# EAGLE design Sens_BMP085_HIH613x (EAGLE 6.3)
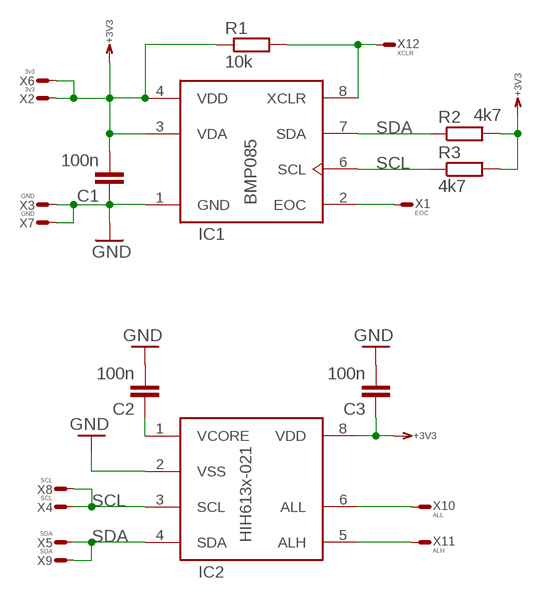
[diagram p0: schematic, sheet 1]

## Parts
C1  100n  C0603  [0603]
C2  100n  C0603  [0603]
C3  100n  C0603  [0603]
IC1  BMP085  [LCC8]
IC2  HIH613x-021  HIH613X  [SO8]
R1  10k  R0603  [0603]
R2  4k7  R0603  [0603]
R3  4k7  R0603  [0603]
X1  EOC  WIREPADR  [S1.27R]
X2  3v3  WIREPADT1.6/0.9  [T1.6/0.9]
X3  GND  WIREPADT1.6/0.9  [T1.6/0.9]
X4  SCL  WIREPADT1.6/0.9  [T1.6/0.9]
X5  SDA  WIREPADT1.6/0.9  [T1.6/0.9]
X6  3v3  WIREPADT1.6/0.9  [T1.6/0.9]
X7  GND  WIREPADT1.6/0.9  [T1.6/0.9]
X8  SCL  WIREPADT1.6/0.9  [T1.6/0.9]
X9  SDA  WIREPADT1.6/0.9  [T1.6/0.9]
X10  ALL  WIREPADR  [S1.27R]
X11  ALH  WIREPADR  [S1.27R]
X12  XCLR  WIREPADR  [S1.27R]

## Nets
+3V3: C1.2 C3.1 IC1.3(VDA) IC1.4(VDD) IC2.8(VDD) R1.1 R2.2 R3.2 X2.1(S) X6.1(S)
ALH: IC2.5(ALH) X11.1(S)
ALL: IC2.6(ALL) X10.1(S)
EOC: IC1.2(EOC) X1.1(S)
GND: C1.1 C2.2 C3.2 IC1.1(GND) IC2.2(VSS) X3.1(S) X7.1(S)
N$1: C2.1 IC2.1(VCORE)
SCL: IC1.6(SCL) IC2.3(SCL) R3.1 X4.1(S) X8.1(S)
SDA: IC1.7(SDA) IC2.4(SDA) R2.1 X5.1(S) X9.1(S)
XCLR: IC1.8(XCLR) R1.2 X12.1(S)

## Library data of the parts
C1-C3 = RCL:C: Capacitor SMD
IC1 = Sensors:BMP085
IC2 = Sensors:HIH613X
R1-R3 = RCL:R: Resistor SMD
X1-X12 = Conn:WIREPAD: Wire PAD connect wire on PCB

## Board
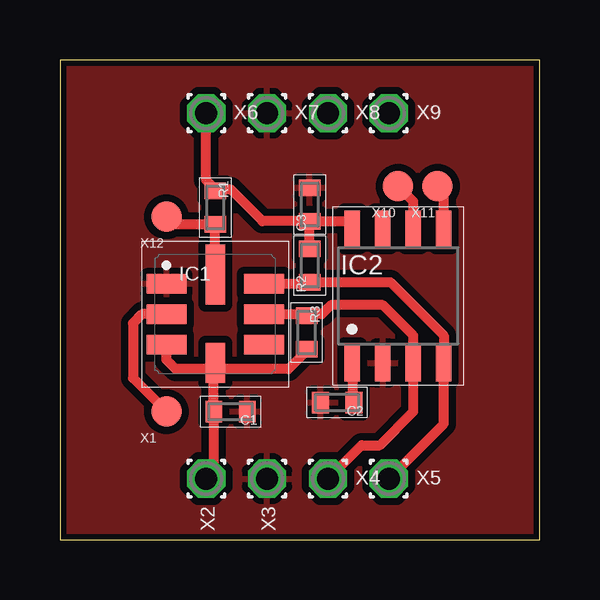
[diagram p1: board, top side]
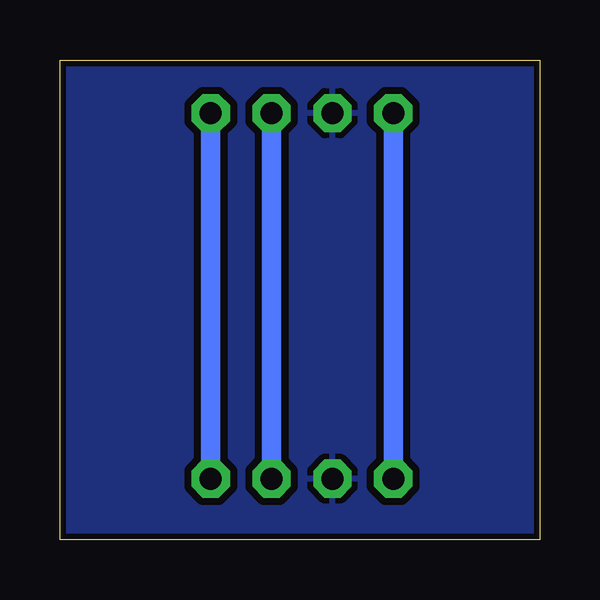
[diagram p2: board, bottom side, seen from below]

Size 20 x 20 mm. Coordinates in mm from the lower left corner, seen from the top.
Outline: 0,0 20,0 20,20 0,20 0,0
Copper layers (1*16): Top 0.035mm / dielectric 1.5mm / Bottom 0.035mm
Design rules: minimum track width 10mil, minimum drill 12mil, track to track 12mil, track to pad 12mil, pad to pad 12mil, via to via 12mil, smd to smd 12mil, copper to edge 10mil, drill to drill 8mil, minimum pad ring 10mil, minimum via ring 8mil, stop-mask expansion 4mil, vias tented up to drill 0mil, thermal gap 10mil

### Footprints (pad centres in the part's own frame; a part is rotated, then mirrored left to right if it is on the bottom)
0603 = smd 0.7 x 0.9: 1 -0.697,0; 2 0.697,0
LCC8 = smd 1.67 x 0.8: 1 -2.032,1.27; 2 -2.032,0; 3 -2.032,-1.27; 5 2.032,-1.27; 6 2.032,0; 7 2.032,1.27 | smd 0.8 x 1.67: 4 0,-2.032 | smd 0.8 x 2.5: 8 0,1.651
SO8 = smd 0.635 x 1.524: 1 -1.905,-2.794; 2 -0.635,-2.794; 3 0.635,-2.794; 4 1.905,-2.794; 5 1.905,2.794; 6 0.635,2.794; 7 -0.635,2.794; 8 -1.905,2.794
S1.27R = smd 1.27 x 1.27: 1 0,0
T1.6/0.9 = drill 0.914 pad 1.6 octagon: 1 0,0

### Placement (x,y rotation side)
C1  7.11,5.33 180 top
C2  11.56,5.71 180 top
C3  10.41,13.97 90 top
IC1  6.48,9.4 0 top
IC2  14.1,10.16 0 top
R1  6.48,13.84 270 top
R2  10.41,11.43 90 top
R3  10.29,8.64 270 top
X1  4.45,5.33 0 top
X2  6.1,2.54 270 top
X3  8.64,2.54 270 top
X4  GND  [T1.6/0.9]  11.18,2.54 0 top
X5  GND  [T1.6/0.9]  13.72,2.54 0 top
X6  6.1,17.78 0 top
X7  8.64,17.78 0 top
X8  GND  [T1.6/0.9]  11.18,17.78 0 top
X9  GND  [T1.6/0.9]  13.72,17.78 0 top
X10  14.1,14.73 0 top
X11  15.75,14.73 0 top
X12  4.45,13.46 0 top

### Tracks (layer width: path | path; a pad name or v marks a point on that pad's centre or on a via)
+3V3
  Top 0.406: 6.48,14.61 6.1,14.99 X6.1 | R1.1 6.48,14.61 | R3.2 10.29,7.87 9.53,7.11 6.48,7.11 | 6.42,7.17 C1.2 6.42,2.86 X2.1 | IC1.4 6.42,7.3 6.42,7.17 | 6.48,14.61 7.11,14.61 8.44,13.27 C3.1 | IC1.3 4.45,7.49 4.83,7.11 6.48,7.11 | 6.42,7.17 6.48,7.11 | C3.1 12.19,13.27 IC2.8 | R2.2 C3.1
  Bottom 0.813: X2.1 X6.1
ALH
  Top 0.406: IC2.5 16,14.48 X11.1
ALL
  Top 0.406: IC2.6 14.73,14.1 X10.1
EOC
  Top 0.406: IC1.2 3.43,9.4 3.05,9.02 3.05,6.73 X1.1
GND
  pour Top: 0,20 20,20 20,0 0,0
  pour Bottom: 0,0 20,0 20,20 0,20
N$1
  Top 0.406: IC2.1 12.19,5.78 C2.1
SCL
  Top 0.406: IC1.6 10.22,9.4 R3.1 10.35,9.4 10.92,9.4 11.3,9.78 13.46,9.78 14.73,8.51 IC2.3 14.73,5.33 13.34,3.94 12.57,3.94 X4.1
  Bottom 0.813: X8.1 X4.1
SDA
  Top 0.406: IC1.7 9.97,10.67 R2.1 13.78,10.73 16,8.51 IC2.4 16,4.83 X5.1
  Bottom 0.813: X9.1 X5.1
XCLR
  Top 0.406: IC1.8 R1.2 4.76,13.15 X12.1